# Altium project PCB_Project_v1.PrjPcb
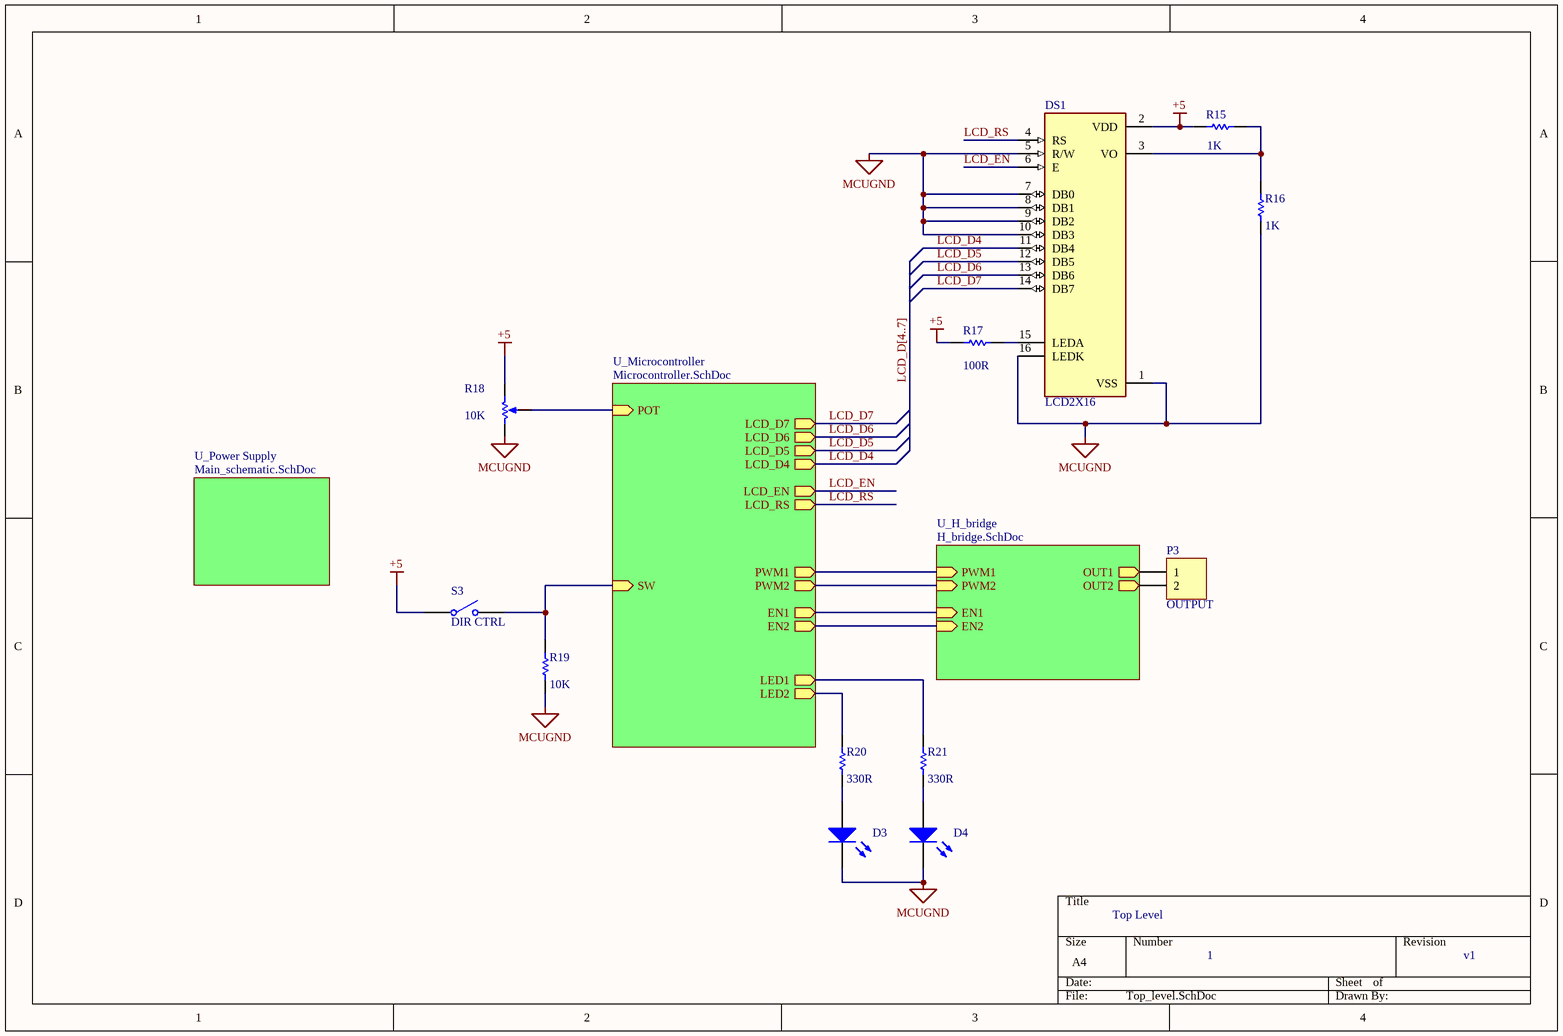
[diagram p0: Top_level.SchDoc]
Title: Main Schematic
2 sheets, 33 parts. Net scope: hierarchical (ports join the sheet entries above them; power ports are global).
Sheets:
  Top_level.SchDoc
    U_H_bridge = H_bridge.SchDoc

## Sheet Top_level.SchDoc: Top Level
size A4; DocumentNumber: 1; Revision: v1; SheetNumber: 1; SheetTotal: 4

### Parts
D3  LED1  [LED-1]  (value not drawn)
D4  LED1  [LED-1]  (value not drawn)
DS1  LCD2X16  [LCD_LCD2X16]
P3  OUTPUT  [HDR1X2]
R15  value 1K  [AXIAL-0.3]  (hidden comment: Res1)
R16  value 1K  [AXIAL-0.3]  (hidden comment: Res1)
R17  value 100R  [AXIAL-0.3]  (hidden comment: Res1)
R18  value 10K  [VR5]  (hidden comment: RPot)
R19  value 10K  [AXIAL-0.3]  (hidden comment: Res1)
R20  value 330R  [AXIAL-0.3]  (hidden comment: Res1)
R21  value 330R  [AXIAL-0.3]  (hidden comment: Res1)
S3  DIR CTRL  [SPST-2]

### Sub-sheets
U_H_bridge = H_bridge.SchDoc: PWM1 (in), PWM2 (in), EN1 (in), EN2 (in), OUT1 (out), OUT2 (out)
U_Microcontroller = Microcontroller.SchDoc (file not in this document): POT (in), SW (in), PWM1 (out), PWM2 (out), LED1 (out), EN1 (out), EN2 (out), LCD_D6 (out), LCD_D5 (out), LCD_D7 (out), LCD_D4 (out), LCD_RS (out), LCD_EN (out), LED2 (out)
U_Power Supply = Main_schematic.SchDoc (file not in this document): no entries

### Nets
+5: DS1.2(VDD) R15.1 R17.1 R18.1(TOP) S3.1(COMMON)
MCUGND: D3.2(K) D4.2(K) DS1.1(VSS) DS1.5(R/W) DS1.7(DB0) DS1.8(DB1) DS1.9(DB2) DS1.10(DB3) DS1.16(LEDK) R16.1 R18.2(BOT) R19.1
LCD_D4: DS1.11(DB4) ; sheet U_Microcontroller/LCD_D4
LCD_D5: DS1.12(DB5) ; sheet U_Microcontroller/LCD_D5
LCD_D6: DS1.13(DB6) ; sheet U_Microcontroller/LCD_D6
LCD_D7: DS1.14(DB7) ; sheet U_Microcontroller/LCD_D7
LCD_EN: DS1.6(E) ; sheet U_Microcontroller/LCD_EN
LCD_RS: DS1.4(RS) ; sheet U_Microcontroller/LCD_RS
NetD3_1: D3.1(A) R20.1
NetD4_1: D4.1(A) R21.1
NetDS1_3: DS1.3(VO) R15.2 R16.2
NetDS1_15: DS1.15(LEDA) R17.2
NetP3_1: P3.1 ; sheet U_H_bridge/OUT1
NetP3_2: P3.2 ; sheet U_H_bridge/OUT2
NetR7_1: sheet U_Microcontroller/EN1, sheet U_H_bridge/EN1
NetR8_1: sheet U_Microcontroller/EN2, sheet U_H_bridge/EN2
NetR9_2: sheet U_Microcontroller/PWM1, sheet U_H_bridge/PWM1
NetR12_2: sheet U_Microcontroller/PWM2, sheet U_H_bridge/PWM2
NetR18_3: R18.3(TAP) ; sheet U_Microcontroller/POT
NetR19_2: R19.2 S3.2(NO) ; sheet U_Microcontroller/SW
NetR20_2: R20.2 ; sheet U_Microcontroller/LED2
NetR21_2: R21.2 ; sheet U_Microcontroller/LED1

### Buses and harness runs
bus LCD_D[4..7]

### Library data of the parts
D3 D4 = LED1: Typical RED GaAs LED; Published: 8-Jun-2000; LatestRevisionDate: 08-Jul-2005; LatestRevisionNote: Mech Layer 1 removed.; PackageReference: LED-1; Publisher: Altium Limited; PackageDescription: LED; 2 Leads
DS1 = LCD2X16: Display; Display: LCD 2x16 characters (blue backlight); MF: mikroElektronika; SnapEDA_Link: https://www.snapeda.com/parts/LCD2X16/mikroElektronika/view-part/2472530/?ref=snap; Price: None; Package: None; Availability: Unavailable; Value: *; MP: LCD2X16
P3 = Header 2: Header, 2-Pin; LatestRevisionDate: 17-Jul-2002; LatestRevisionNote: Re-released for DXP Platform.; Publisher: Altium Limited
R15-R17 R19-R21 = Res1: Resistor; Published: 8-Jun-2000; LatestRevisionDate: 17-Jul-2002; LatestRevisionNote: Re-released for DXP Platform.; PackageReference: AXIAL-0.3; Publisher: Altium Limited; PackageDescription: Axial Device, Thru-Hole; 2 Leads; 0.3 in Pin Spacing
R18 = RPot: Potentiometer; Sim Note: Enter the Resistance value and the set point into parameter fields.; Set Position: 0.5; Published: 8-Jun-2000; LatestRevisionDate: 17-Jul-2002; LatestRevisionNote: Re-released for DXP Platform.; PackageReference: VR5; Publisher: Altium Limited; PackageDescription: Variable Resistor, Thru-Hole; 3 Leads
S3 = SW-SPST: Single-Pole, Single-Throw Switch; Published: 24-Mar-1999; LatestRevisionDate: 17-Jul-2002; LatestRevisionNote: Re-released for DXP Platform.; PackageReference: SPST-2; Publisher: Altium Limited; PackageDescription: Switch; 2 Leads

## Sheet H_bridge.SchDoc: H-Bridge
size A4; DocumentNumber: 4; Revision: v1; SheetNumber: 4; SheetTotal: 4
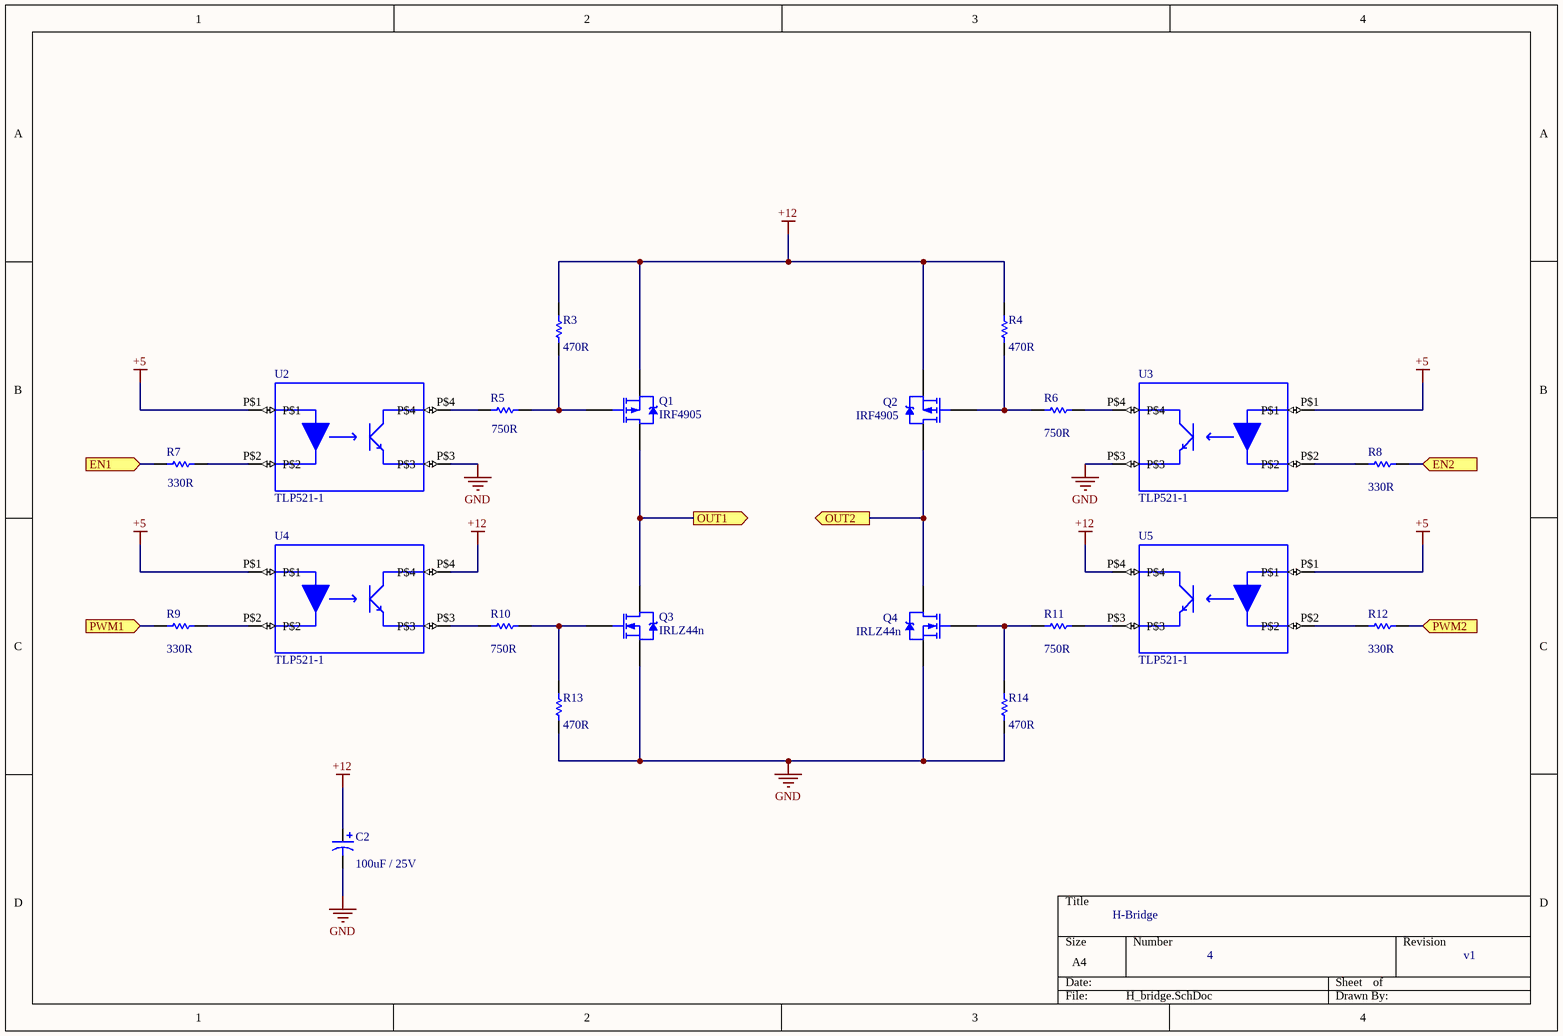
[diagram p1: H_bridge.SchDoc]

### Parts
C2  value 100uF / 25V  [RB7.6-15]  (hidden comment: Cap Pol1)
Q1  IRF4905  [TO-220AB]
Q2  IRF4905  [TO-220AB]
Q3  IRLZ44n  [TO-220AB]
Q4  IRLZ44n  [TO-220AB]
R3  value 470R  [AXIAL-0.3]  (hidden comment: Res1)
R4  value 470R  [AXIAL-0.3]  (hidden comment: Res1)
R5  value 750R  [AXIAL-0.3]  (hidden comment: Res1)
R6  value 750R  [AXIAL-0.3]  (hidden comment: Res1)
R7  value 330R  [AXIAL-0.3]  (hidden comment: Res1)
R8  value 330R  [AXIAL-0.3]  (hidden comment: Res1)
R9  value 330R  [AXIAL-0.3]  (hidden comment: Res1)
R10  value 750R  [AXIAL-0.3]  (hidden comment: Res1)
R11  value 750R  [AXIAL-0.3]  (hidden comment: Res1)
R12  value 330R  [AXIAL-0.3]  (hidden comment: Res1)
R13  value 470R  [AXIAL-0.3]  (hidden comment: Res1)
R14  value 470R  [AXIAL-0.3]  (hidden comment: Res1)
U2  TLP521-1  [TLP521-1]
U3  TLP521-1  [TLP521-1]
U4  TLP521-1  [TLP521-1]
U5  TLP521-1  [TLP521-1]

### Ports
EN1 (in), EN2 (in), OUT1 (out), OUT2 (out), PWM1 (in), PWM2 (in)

### Nets
+5: U2.P$1 U3.P$1 U4.P$1 U5.P$1
+12: C2.1 Q1.3(S) Q2.3(S) R3.2 R4.2 U4.P$4 U5.P$4
GND: C2.2 Q3.3(S) Q4.3(S) R13.2 R14.2 U2.P$3 U3.P$3
NetP3_1: Q1.2(D) Q3.2(D) ; port OUT1
NetP3_2: Q2.2(D) Q4.2(D) ; port OUT2
NetQ1_1: Q1.1(G) R3.1 R5.2
NetQ2_1: Q2.1(G) R4.1 R6.2
NetQ3_1: Q3.1(G) R10.1 R13.1
NetQ4_1: Q4.1(G) R11.1 R14.1
NetR5_1: R5.1 U2.P$4
NetR6_1: R6.1 U3.P$4
NetR7_1: R7.1 ; port EN1
NetR7_2: R7.2 U2.P$2
NetR8_1: R8.1 ; port EN2
NetR8_2: R8.2 U3.P$2
NetR9_1: R9.1 U4.P$2
NetR9_2: R9.2 ; port PWM1
NetR10_2: R10.2 U4.P$3
NetR11_2: R11.2 U5.P$3
NetR12_1: R12.1 U5.P$2
NetR12_2: R12.2 ; port PWM2

### Library data of the parts
C2 = Cap Pol1: Polarized Capacitor (Radial); Published: 8-Jun-2000; LatestRevisionDate: 17-Jul-2002; LatestRevisionNote: Re-released for DXP Platform.; PackageReference: RB7.6-15; Publisher: Altium Limited; PackageDescription: Polarized Capacitor (Radial); 2 Leads
Q1 Q2 = PMOS-2: P-Channel Power MOSFET; Note: Pin 4 not drawn and electrically connected to Pin 2.; Published: 8-Jun-2000; LatestRevisionDate: 17-Jul-2002; LatestRevisionNote: Re-released for DXP Platform.; DatasheetVersion: PD-9.390D; PackageVersion: Feb-1997; PackageReference: TO-220AB; Publisher: Altium Limited; PackageDescription: TO, Thru-Hole, Vertical, Heatsink Mounted; 3 In-Line Leads; Pitch 2.54 mm; ComponentLink1Description: Manufacturer Link; ComponentLink1URL: http://www.irf.com/
Q3 Q4 = NMOS-2: N-Channel Power MOSFET; Note: Pin 2 is electrically connected to pin 4.; Published: 8-Jun-2000; LatestRevisionDate: 17-Jul-2002; LatestRevisionNote: Re-released for DXP Platform.; DatasheetVersion: PD-9.814; PackageVersion: Feb-1997; PackageReference: TO-220AB; Publisher: Altium Limited; PackageDescription: TO, Thru-Hole, Vertical, Heatsink Mounted; 3 In-Line Leads; Pitch 2.54 mm; ComponentLink1Description: Manufacturer Link; ComponentLink1URL: http://www.irf.com/
R3-R14 = Res1: Resistor; Published: 8-Jun-2000; LatestRevisionDate: 17-Jul-2002; LatestRevisionNote: Re-released for DXP Platform.; PackageReference: AXIAL-0.3; Publisher: Altium Limited; PackageDescription: Axial Device, Thru-Hole; 2 Leads; 0.3 in Pin Spacing
U2-U5 = TLP521-1: ICM006; MF: Isocom; Package: None; Availability: Unavailable; SnapEDA_Link: https://www.snapeda.com/parts/TLP521-1/Isocom/view-part/918682/?ref=snap; MP: TLP521-1; Price: None; Value: *

## Nets that join several sheets
+5: Top_level (5 pins), H_bridge (U2.P$1 U3.P$1 U4.P$1 U5.P$1)
NetP3_1: Top_level (P3.1), H_bridge (Q1.2 Q3.2)
NetP3_2: Top_level (P3.2), H_bridge (Q2.2 Q4.2)